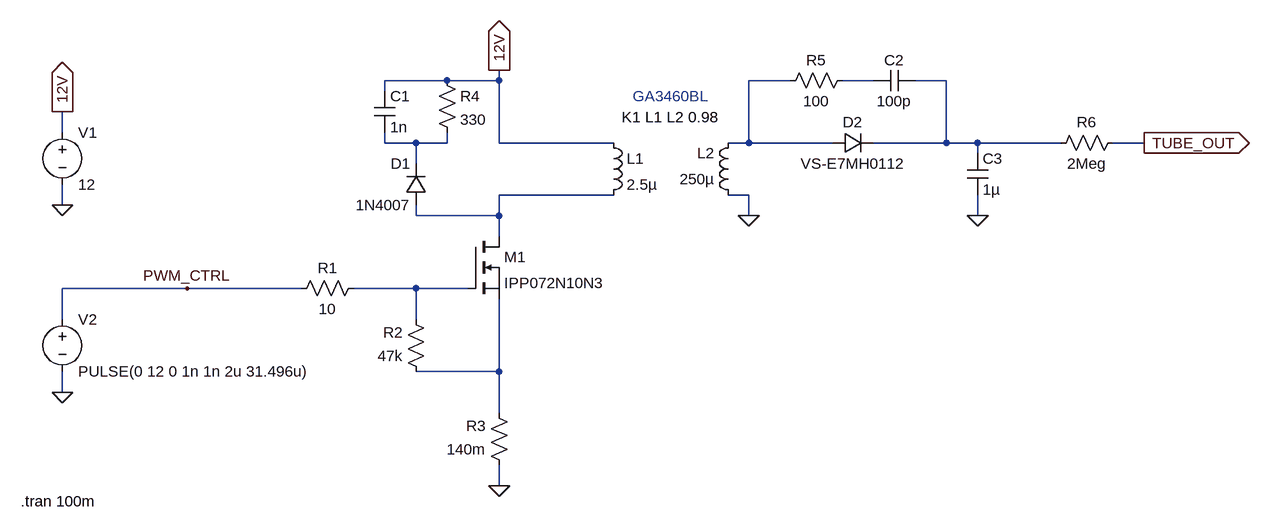
[diagram p0: schematic RaSens.asc]
RaSens.asc, the LTspice schematic file:
Version 4.1
SHEET 1 1432 680
WIRE 176 -128 80 -128
WIRE 256 -128 256 -144
WIRE 256 -128 176 -128
WIRE 704 -128 640 -128
WIRE 832 -128 784 -128
WIRE 944 -128 896 -128
WIRE 80 -112 80 -128
WIRE -416 -48 -416 -80
WIRE 80 -32 80 -48
WIRE 128 -32 80 -32
WIRE 176 -32 176 -48
WIRE 176 -32 128 -32
WIRE 256 -32 256 -128
WIRE 432 -32 256 -32
WIRE 640 -32 640 -128
WIRE 640 -32 608 -32
WIRE 768 -32 640 -32
WIRE 944 -32 944 -128
WIRE 944 -32 832 -32
WIRE 992 -32 944 -32
WIRE 1120 -32 992 -32
WIRE 1248 -32 1200 -32
WIRE 992 -16 992 -32
WIRE 128 0 128 -32
WIRE 432 48 256 48
WIRE 640 48 608 48
WIRE -416 64 -416 32
WIRE 128 80 128 64
WIRE 256 80 256 48
WIRE 256 80 128 80
WIRE 640 80 640 48
WIRE 992 80 992 48
WIRE 256 112 256 80
WIRE -224 192 -416 192
WIRE -48 192 -224 192
WIRE 128 192 32 192
WIRE 208 192 128 192
WIRE -416 240 -416 192
WIRE 128 240 128 192
WIRE 256 320 256 208
WIRE 256 320 128 320
WIRE -416 352 -416 320
WIRE 256 384 256 320
WIRE 256 496 256 464
FLAG 256 496 0
FLAG -416 64 0
FLAG -416 -80 12V
IOPIN -416 -80 Out
FLAG 256 -144 12V
IOPIN 256 -144 Out
FLAG -416 352 0
FLAG 640 80 0
FLAG 992 80 0
FLAG 1248 -32 TUBE_OUT
IOPIN 1248 -32 Out
FLAG -224 192 PWM_CTRL
SYMBOL nmos 208 112 R0
SYMATTR InstName M1
SYMATTR Value IPP072N10N3
SYMBOL res 48 176 R90
WINDOW 0 0 56 VBottom 2
WINDOW 3 32 56 VTop 2
SYMATTR InstName R1
SYMATTR Value 10
SYMBOL res 144 336 R180
WINDOW 0 36 76 Left 2
WINDOW 3 36 40 Left 2
SYMATTR InstName R2
SYMATTR Value 47k
SYMBOL res 272 480 R180
WINDOW 0 36 76 Left 2
WINDOW 3 36 40 Left 2
SYMATTR InstName R3
SYMATTR Value 140m
SYMBOL ind 416 -48 R0
SYMATTR InstName L1
SYMATTR Value 2.5µ
SYMATTR Type ind
SYMATTR SpiceLine Ipk=50 Rser=5.63m
SYMBOL diode 144 64 R180
WINDOW 0 24 64 Left 2
WINDOW 3 24 0 Left 2
SYMATTR InstName D1
SYMATTR Value 1N4007
SYMBOL cap 64 -112 R0
SYMATTR InstName C1
SYMATTR Value 1n
SYMBOL res 160 -144 R0
SYMATTR InstName R4
SYMATTR Value 330
SYMBOL ind 624 64 R180
WINDOW 0 36 80 Left 2
WINDOW 3 36 40 Left 2
SYMATTR InstName L2
SYMATTR Value 250µ
SYMATTR Type ind
SYMATTR SpiceLine Rser=400m
SYMBOL voltage -416 -64 R0
WINDOW 123 0 0 Left 0
WINDOW 39 0 0 Left 0
SYMATTR InstName V1
SYMATTR Value 12
SYMBOL voltage -416 224 R0
WINDOW 123 0 0 Left 0
WINDOW 39 0 0 Left 0
SYMATTR InstName V2
SYMATTR Value PULSE(0 12 0 1n 1n 2u 31.496u)
SYMBOL diode 768 -48 M90
WINDOW 0 0 32 VBottom 2
WINDOW 3 32 32 VTop 2
SYMATTR InstName D2
SYMATTR Value VS-E7MH0112
SYMBOL res 800 -144 R90
WINDOW 0 0 56 VBottom 2
WINDOW 3 32 56 VTop 2
SYMATTR InstName R5
SYMATTR Value 100
SYMBOL cap 896 -144 R90
WINDOW 0 0 32 VBottom 2
WINDOW 3 32 32 VTop 2
SYMATTR InstName C2
SYMATTR Value 100p
SYMBOL cap 976 -16 R0
SYMATTR InstName C3
SYMATTR Value 1µ
SYMBOL res 1216 -48 R90
WINDOW 0 0 56 VBottom 2
WINDOW 3 32 56 VTop 2
SYMATTR InstName R6
SYMATTR Value 2Meg
TEXT 520 -72 Center 2 !K1 L1 L2 0.98
TEXT 520 -104 Center 2 ;GA3460BL
TEXT -480 520 Left 2 !.tran 100m

The netlist it stands for:
* RaSens.asc
M1 N005 N006 N007 N007 IPP072N10N3
R1 N006 PWM_CTRL 10
R2 N007 N006 47k
R3 0 N007 140m
L1 12V N005 2.5µ Ipk=50 Rser=5.63m
D1 N005 N004 1N4007
C1 12V N004 1n
R4 12V N004 330
L2 0 N001 250µ Rser=400m
V1 12V 0 12
V2 PWM_CTRL 0 PULSE(0 12 0 1n 1n 2u 31.496u)
D2 N001 N003 VS-E7MH0112
R5 N002 N001 100
C2 N003 N002 100p
C3 N003 0 1µ
R6 TUBE_OUT N003 2Meg
.model D D
.lib standard.dio
.model NMOS NMOS
.model PMOS PMOS
.lib standard.mos
K1 L1 L2 0.98
* GA3460BL
.tran 100m
.backanno
.end